# Altium project ledespverynice.PrjPcb
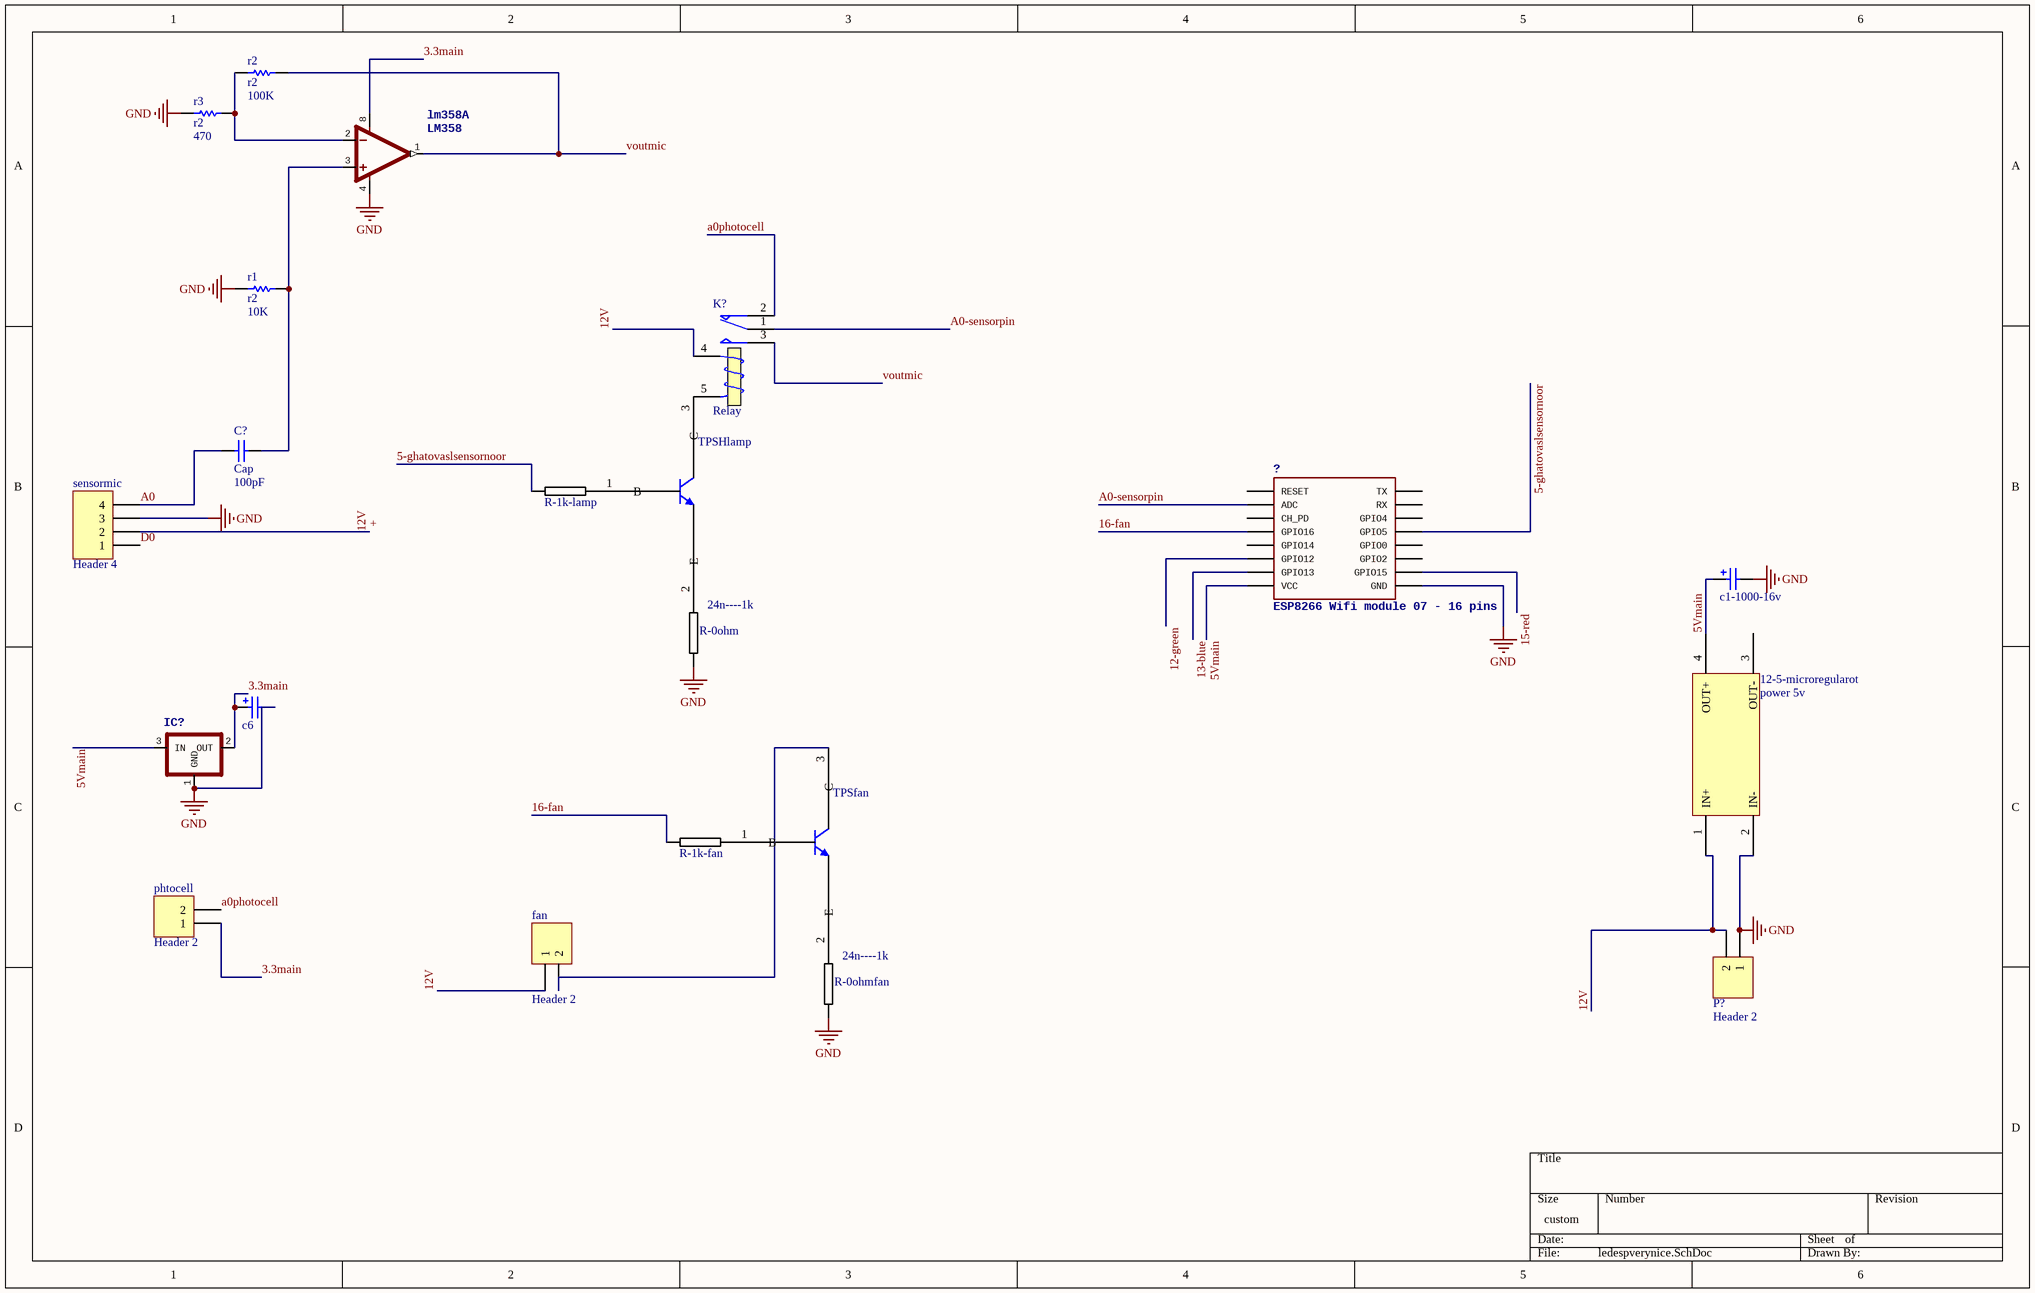
[diagram p0: ledespverynice.SchDoc]
1 sheet, 21 parts. Net scope: global (net labels, ports and power ports of the same name join across sheets).

## Sheet ledespverynice.SchDoc
size 381 x 241 mm

### Parts
12-5-microregularot  power 5v  [regulator5V]
?  ESP8266 Wifi module 07 - 16 pins  [ESP07-16PIN]
c1-1000-16v  C1  [C - 220 n 35]  (value not drawn)
c6  C1  [C - 220 n 35]  (value not drawn)
C?  Cap  value 100pF  [RAD-0.3]
fan  Header 2  [HDR1X2]
IC?  800mA Low-Dropout Linear Regulator  Source: http://www.ti.com/lit/ds/symlink/lm1117-n.pdf  [TO220H]  (value not drawn)
K?  Relay  [MODULE5B]
lm358  LM358  [DIP08]  (part A of 2)
P?  Header 2  [HDR1X2]
phtocell  Header 2  [HDR1X2]
r1  r2  value 10K  [AXIAL-0.3]
r2  r2  value 100K  [AXIAL-0.3]
r3  r2  value 470  [AXIAL-0.3]
R-0ohm  470  [0805R-220]  (value not drawn)
R-0ohmfan  470  [0805R-220]  (value not drawn)
R-1k-fan  1kR  [0805R-220]  (value not drawn)
R-1k-lamp  1kR  [0805R-220]  (value not drawn)
sensormic  Header 4  [HDR1X4]
TPSfan  2N3904  [NPNSMD-TRANSISTOR]  (value not drawn)
TPSHlamp  2N3904  [NPNSMD-TRANSISTOR]  (value not drawn)

### Nets
GND: 12-5-microregularot.2(IN-) ?.GND c1-1000-16v.1 c6.1 IC?.1(GND) lm358.4(V-) P?.1 r1.1 r3.1 R-0ohm.2 R-0ohmfan.2 sensormic.3
3.3main: c6.2 IC?.2(OUT) lm358.8(V+) phtocell.1
5-ghatovaslsensornoor: ?.GPIO5 R-1k-lamp.2
5Vmain: 12-5-microregularot.4(OUT+) ?.VCC c1-1000-16v.2 IC?.3(IN)
12-green: ?.GPIO12
13-blue: ?.GPIO13
15-red: ?.GPIO15
16-fan: ?.GPIO16 R-1k-fan.2
+: 12-5-microregularot.1(IN+) fan.1 K?.4(T1) P?.2 sensormic.2  [also labelled 12V]
A0: C?.1 sensormic.4
A0-sensorpin: ?.ADC K?.1(COM)
a0photocell: K?.2(NC) phtocell.2
D0: sensormic.1
voutmic: K?.3(NO) lm358.1(OUT) r2.2
NetC?_2: C?.2 lm358.3(+IN) r1.2
Netfan_2: fan.2 TPSfan.3(C)
NetK?_5: K?.5(T2) TPSHlamp.3(C)
Netlm358_2: lm358.2(-IN) r2.1 r3.2
NetR-0ohm_1: R-0ohm.1 TPSHlamp.2(E)
NetR-0ohmfan_1: R-0ohmfan.1 TPSfan.2(E)
NetR-1k-fan_1: R-1k-fan.1 TPSfan.1(B)
NetR-1k-lamp_1: R-1k-lamp.1 TPSHlamp.1(B)

Not connected (* = marked no-connect by the designer): 12-5-microregularot 3(OUT-); ? CH_PD GPIO0 GPIO2 GPIO4 GPIO14 REST(RESET) RX TX

### Notes on the sheet
- (near R-0ohm) 24n----1k
- (near R-0ohmfan) 24n----1k

### Library data of the parts
12-5-microregularot = power_1
? = ESP07-16PIN: PITCH: 0.078" / 2 mm; DIMENSIONS: 22.0 x 16.0 mm; PINS: 16
c1-1000-16v c6 = Cap Pol3: Polarized Capacitor (Surface Mount); Value: 200nF; Published: 8-Jun-2000; LatestRevisionDate: 29-May-2009; LatestRevisionNote: IPC-7351 Footprint Added.; PackageReference: C0805; Publisher: Altium Limited; PackageDescription: Chip Capacitor
C? = Cap: Capacitor; Published: 8-Jun-2000; LatestRevisionDate: 17-Jul-2002; LatestRevisionNote: Re-released for DXP Platform.; PackageReference: RAD-0.3; Publisher: Altium Limited; PackageDescription: Radial Cap, Thru-Hole; 2 Leads; 0.3 in Pin Spacing
fan P? phtocell = Header 2: Header, 2-Pin; LatestRevisionDate: 17-Jul-2002; LatestRevisionNote: Re-released for DXP Platform.; Publisher: Altium Limited
IC? = LM1117?-*T(H): MPN: LM1117T-2.5; MPN: LM1117T-3.3; MPN: LM1117T-5.0; MF: Texas Instruments; OC_FARNELL: 1798354; OC_NEWARK: 75R2090; OC_FARNELL: 1469056; OC_NEWARK: 13B5347; OC_FARNELL: 1215183; OC_NEWARK: 41K3491
K? = Relay: SPDT Relay; Published: 8-Jun-2000; LatestRevisionDate: 17-Jul-2002; LatestRevisionNote: Re-released for DXP Platform.; PackageReference: MODULE5B; Publisher: Altium Limited
lm358 = LM358: MF: NXP Semiconductors; Price: None; Package: None; Availability: Unavailable; MP: LM358
r1-r3 = Res1: Resistor; Published: 8-Jun-2000; LatestRevisionDate: 17-Jul-2002; LatestRevisionNote: Re-released for DXP Platform.; PackageReference: AXIAL-0.3; Publisher: Altium Limited; PackageDescription: Axial Device, Thru-Hole; 2 Leads; 0.3 in Pin Spacing
R-0ohm R-0ohmfan R-1k-fan R-1k-lamp = 0805R-220: RESISTOR 0805 1/4 WATT THIN FILM; Reel: *
sensormic = Header 4: Header, 4-Pin; LatestRevisionDate: 17-Jul-2002; LatestRevisionNote: Re-released for DXP Platform.; Publisher: Altium Limited
TPSfan TPSHlamp = 2N3904: NPN General Purpose Amplifier; Published: 8-Jun-2000; LatestRevisionDate: 15-Jan-2003; LatestRevisionNote: PCB Footprint 'BCY-W3/D4.7' replaced; DatasheetVersion: 1997; PackageVersion: Sep-1998; PackageReference: TO-92A; Publisher: Altium Limited; PackageDescription: TO, Flat Index; 3 In-Line, Axial Leads; Body Dia. 4.5mm; Leads 0.51 x 0.48 mm (max); ComponentLink1Description: Manufacturer Link; ComponentLink1URL: http://www.fairchildsemi.com/; ComponentLink2Description: Datasheet; ComponentLink2URL: http://www.fairchildsemi.com/ds/2N%2F2N3904.pdf